# EAGLE design Instruction Register (EAGLE 9.6.1)
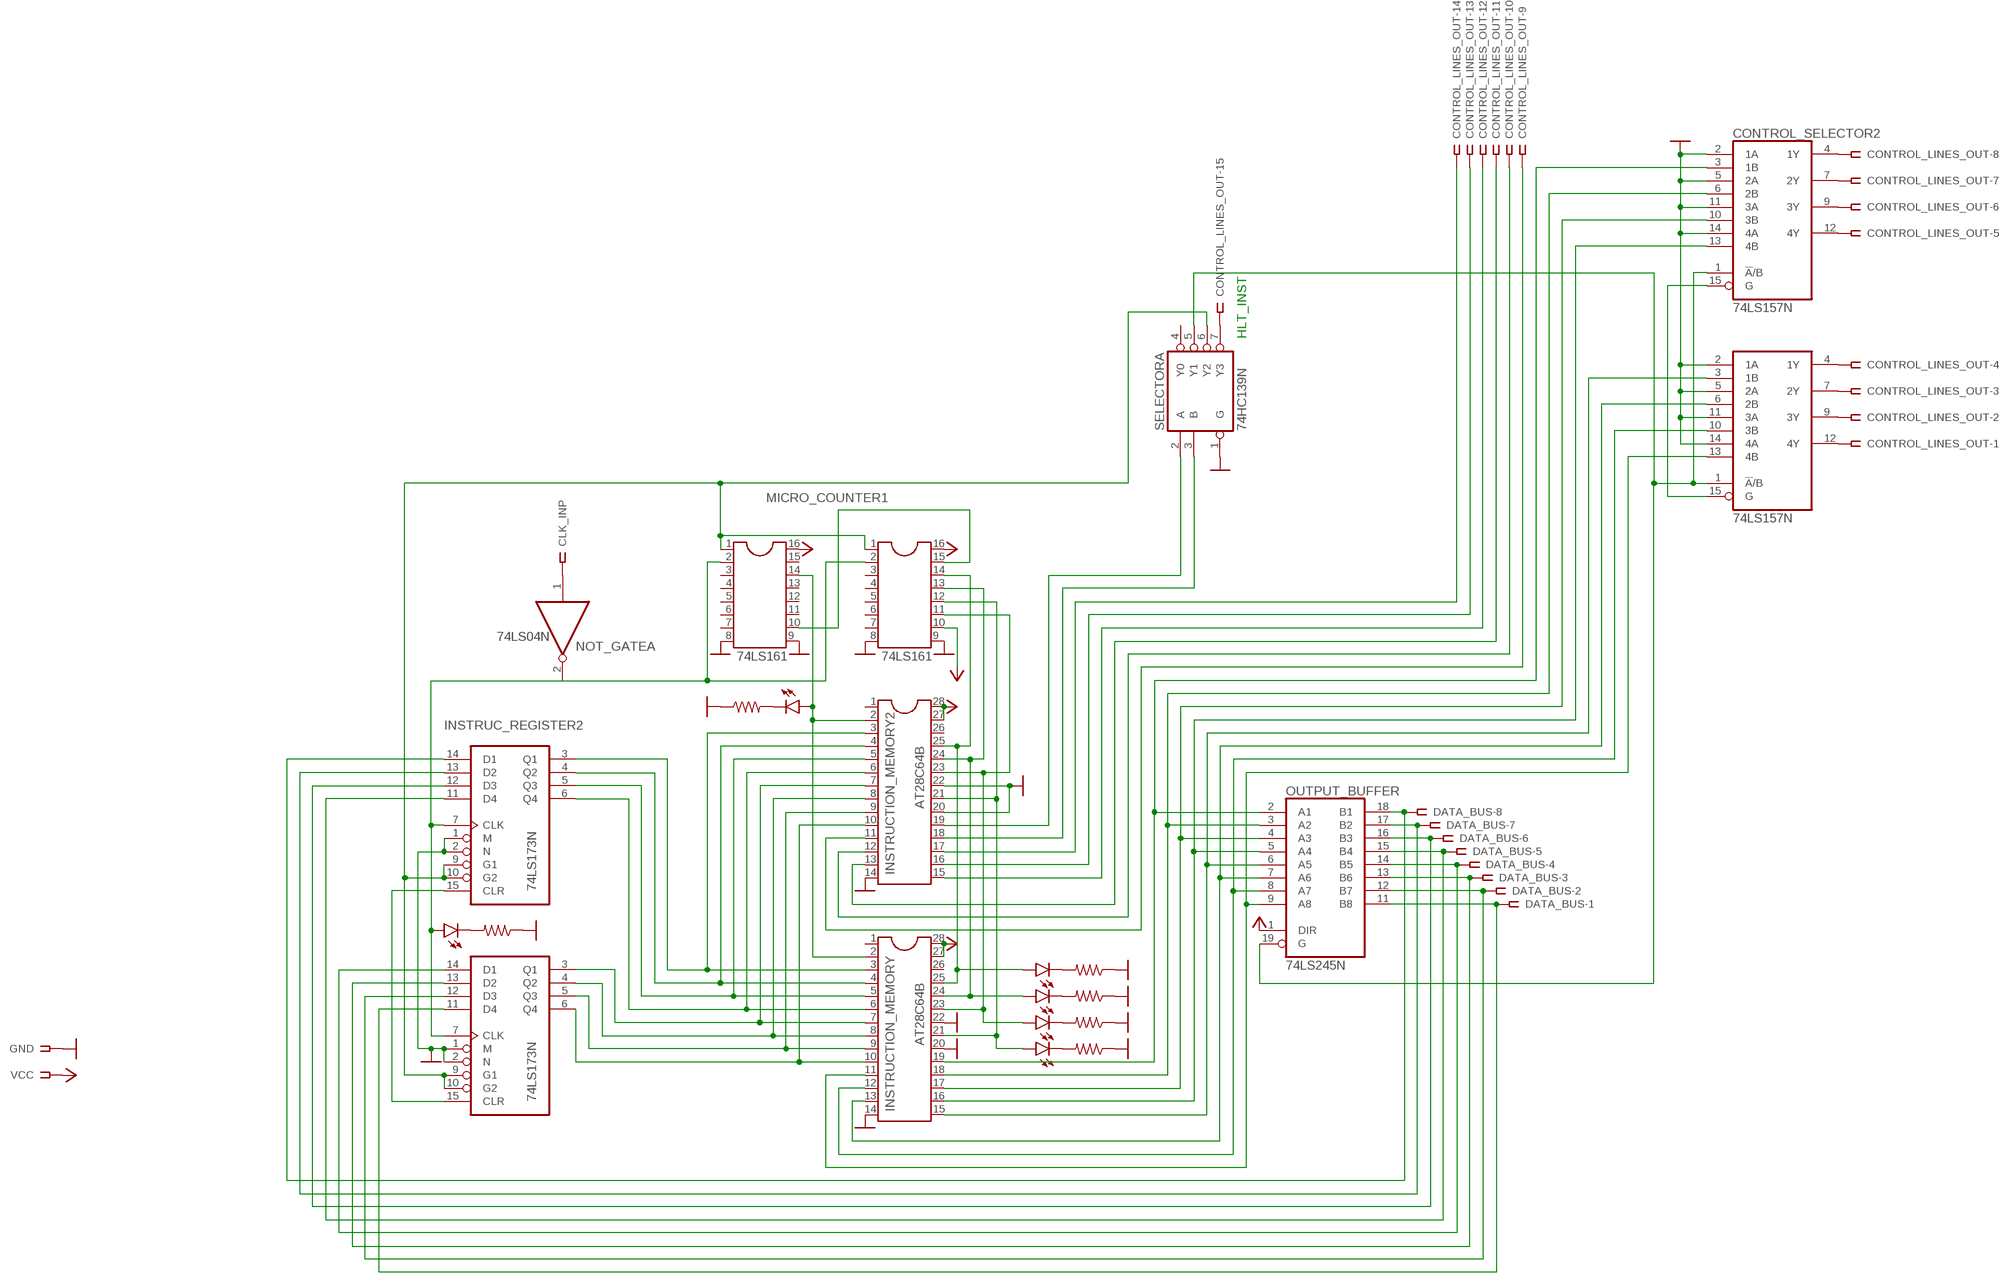
[diagram p0: schematic, sheet 1]

## Parts
CLK_INP  SSW-101-02-G-S-RA  [SSW-101-02-G-S-RA]
CONTROL_LINES_OUT  SSW-115-02-G-S  [SSW-115-02-G-S]
CONTROL_SELECTOR  74LS157N  [DIL16]
CONTROL_SELECTOR2  74LS157N  [DIL16]
DATA_BUS  SSW-108-02-G-S  [SSW-108-02-G-S]
GND  SSW-101-02-G-S-RA  [SSW-101-02-G-S-RA]
I_ADDRESS_REGISTER  74LS173N  [DIL16]
INSTRUC_REGISTER2  74LS173N  [DIL16]
INSTRUCTION_MEMORY  AT28C64B  DIL28  [DIL28-6]
INSTRUCTION_MEMORY2  AT28C64B  DIL28  [DIL28-6]
INVERTED_CLK  LED5MM  [LED5MM]
LED18  LED5MM  [LED5MM]
LED19  LED5MM  [LED5MM]
LED20  LED5MM  [LED5MM]
LED21  LED5MM  [LED5MM]
LED22  LED5MM  [LED5MM]
MICRO_COUNTER  74LS161  DIL16  [DIL16]
MICRO_COUNTER1  74LS161  DIL16  [DIL16]
NOT_GATE  74LS04N  [DIL14]
OUTPUT_BUFFER  74LS245N  [DIL20]
R1  ~220  R-US_0204/7  [0204/7]
R18  ~220  R-US_0204/7  [0204/7]
R19  ~220  R-US_0204/7  [0204/7]
R20  ~220  R-US_0204/7  [0204/7]
R21  ~220  R-US_0204/7  [0204/7]
R22  ~220  R-US_0204/7  [0204/7]
SELECTOR  74HC139N  [DIL16]
VCC  SSW-101-02-G-S-RA  [SSW-101-02-G-S-RA]

## Nets
GND: CONTROL_SELECTOR2.2(1A) CONTROL_SELECTOR2.5(2A) CONTROL_SELECTOR2.11(3A) CONTROL_SELECTOR2.14(4A) CONTROL_SELECTOR.2(1A) CONTROL_SELECTOR.5(2A) CONTROL_SELECTOR.11(3A) CONTROL_SELECTOR.14(4A) GND.1 I_ADDRESS_REGISTER.1(M) I_ADDRESS_REGISTER.2(N) INSTRUC_REGISTER2.1(M) INSTRUC_REGISTER2.2(N) INSTRUCTION_MEMORY2.14 INSTRUCTION_MEMORY2.20 INSTRUCTION_MEMORY2.22 INSTRUCTION_MEMORY.14 INSTRUCTION_MEMORY.20 INSTRUCTION_MEMORY.22 MICRO_COUNTER1.8 MICRO_COUNTER1.9 MICRO_COUNTER.8 MICRO_COUNTER.9 R1.1 R18.1 R19.1 R20.1 R21.1 R22.1 SELECTOR.1(A:G)
N$1: I_ADDRESS_REGISTER.6(Q4) INSTRUCTION_MEMORY2.10 INSTRUCTION_MEMORY.10
N$2: I_ADDRESS_REGISTER.5(Q3) INSTRUCTION_MEMORY2.9 INSTRUCTION_MEMORY.9
N$3: I_ADDRESS_REGISTER.4(Q2) INSTRUCTION_MEMORY2.8 INSTRUCTION_MEMORY.8
N$4: I_ADDRESS_REGISTER.3(Q1) INSTRUCTION_MEMORY2.7 INSTRUCTION_MEMORY.7
N$5: INSTRUC_REGISTER2.6(Q4) INSTRUCTION_MEMORY2.6 INSTRUCTION_MEMORY.6
N$6: INSTRUC_REGISTER2.5(Q3) INSTRUCTION_MEMORY2.5 INSTRUCTION_MEMORY.5
N$7: INSTRUC_REGISTER2.4(Q2) INSTRUCTION_MEMORY2.4 INSTRUCTION_MEMORY.4
N$8: INSTRUC_REGISTER2.3(Q1) INSTRUCTION_MEMORY2.3 INSTRUCTION_MEMORY.3
N$9: CONTROL_LINES_OUT.9 INSTRUCTION_MEMORY2.11
N$10: CONTROL_SELECTOR.6(2B) INSTRUCTION_MEMORY.13 OUTPUT_BUFFER.7(A6)
N$11: CONTROL_SELECTOR2.1(!A!/B) CONTROL_SELECTOR.1(!A!/B) OUTPUT_BUFFER.19(G) SELECTOR.5(A:Y1)
N$12: CONTROL_SELECTOR2.15(G) CONTROL_SELECTOR.15(G)
N$13: CONTROL_LINES_OUT.1 CONTROL_SELECTOR.12(4Y)
N$14: CONTROL_LINES_OUT.2 CONTROL_SELECTOR.9(3Y)
N$15: CONTROL_LINES_OUT.3 CONTROL_SELECTOR.7(2Y)
N$16: CONTROL_LINES_OUT.4 CONTROL_SELECTOR.4(1Y)
N$17: CONTROL_LINES_OUT.5 CONTROL_SELECTOR2.12(4Y)
N$18: CONTROL_LINES_OUT.6 CONTROL_SELECTOR2.9(3Y)
N$19: CONTROL_LINES_OUT.7 CONTROL_SELECTOR2.7(2Y)
N$20: CONTROL_LINES_OUT.8 CONTROL_SELECTOR2.4(1Y)
N$21: INSTRUCTION_MEMORY2.19 SELECTOR.2(A:A)
N$23: I_ADDRESS_REGISTER.9(G1) I_ADDRESS_REGISTER.10(G2) INSTRUC_REGISTER2.9(G1) INSTRUC_REGISTER2.10(G2) MICRO_COUNTER1.1 MICRO_COUNTER.1 SELECTOR.6(A:Y2)
N$25: CONTROL_LINES_OUT.15 SELECTOR.7(A:Y3)
N$26: CLK_INP.1 NOT_GATE.1(A:I)
N$27: INVERTED_CLK.K(C) R1.2
N$29: DATA_BUS.1 I_ADDRESS_REGISTER.11(D4) OUTPUT_BUFFER.11(B8)
N$30: DATA_BUS.2 I_ADDRESS_REGISTER.12(D3) OUTPUT_BUFFER.12(B7)
N$31: DATA_BUS.3 I_ADDRESS_REGISTER.13(D2) OUTPUT_BUFFER.13(B6)
N$32: DATA_BUS.4 I_ADDRESS_REGISTER.14(D1) OUTPUT_BUFFER.14(B5)
N$33: DATA_BUS.5 INSTRUC_REGISTER2.11(D4) OUTPUT_BUFFER.15(B4)
N$34: DATA_BUS.6 INSTRUC_REGISTER2.12(D3) OUTPUT_BUFFER.16(B3)
N$35: DATA_BUS.7 INSTRUC_REGISTER2.13(D2) OUTPUT_BUFFER.17(B2)
N$36: DATA_BUS.8 INSTRUC_REGISTER2.14(D1) OUTPUT_BUFFER.18(B1)
N$37: CONTROL_SELECTOR.10(3B) INSTRUCTION_MEMORY.12 OUTPUT_BUFFER.8(A7)
N$38: CONTROL_SELECTOR.13(4B) INSTRUCTION_MEMORY.11 OUTPUT_BUFFER.9(A8)
N$39: CONTROL_SELECTOR.3(1B) INSTRUCTION_MEMORY.15 OUTPUT_BUFFER.6(A5)
N$40: CONTROL_SELECTOR2.13(4B) INSTRUCTION_MEMORY.16 OUTPUT_BUFFER.5(A4)
N$41: CONTROL_SELECTOR2.10(3B) INSTRUCTION_MEMORY.17 OUTPUT_BUFFER.4(A3)
N$42: CONTROL_SELECTOR2.6(2B) INSTRUCTION_MEMORY.18 OUTPUT_BUFFER.3(A2)
N$43: CONTROL_SELECTOR2.3(1B) INSTRUCTION_MEMORY.19 OUTPUT_BUFFER.2(A1)
N$45: CONTROL_LINES_OUT.11 INSTRUCTION_MEMORY2.13
N$46: CONTROL_LINES_OUT.10 INSTRUCTION_MEMORY2.12
N$47: CONTROL_LINES_OUT.12 INSTRUCTION_MEMORY2.15
N$48: CONTROL_LINES_OUT.13 INSTRUCTION_MEMORY2.16
N$49: CONTROL_LINES_OUT.14 INSTRUCTION_MEMORY2.17
N$50: INSTRUCTION_MEMORY2.18 SELECTOR.3(A:B)
N$52: MICRO_COUNTER1.10 MICRO_COUNTER.15
N$53: INSTRUCTION_MEMORY2.25 INSTRUCTION_MEMORY.25 LED18.A MICRO_COUNTER.14
N$54: INSTRUCTION_MEMORY2.24 INSTRUCTION_MEMORY.24 LED19.A MICRO_COUNTER.13
N$55: INSTRUCTION_MEMORY2.21 INSTRUCTION_MEMORY.21 LED21.A MICRO_COUNTER.12
N$56: INSTRUCTION_MEMORY2.23 INSTRUCTION_MEMORY.23 LED20.A MICRO_COUNTER.11
N$57: INSTRUCTION_MEMORY2.2 INSTRUCTION_MEMORY.2 LED22.A MICRO_COUNTER1.14
N$67: I_ADDRESS_REGISTER.15(CLR) INSTRUC_REGISTER2.15(CLR)
N$70: I_ADDRESS_REGISTER.7(CLK) INSTRUC_REGISTER2.7(CLK) INVERTED_CLK.A MICRO_COUNTER1.2 MICRO_COUNTER.2 NOT_GATE.2(A:O)
N$88: LED18.K(C) R18.2
N$89: LED19.K(C) R19.2
N$90: LED20.K(C) R20.2
N$91: LED21.K(C) R21.2
N$92: LED22.K(C) R22.2
VCC: INSTRUCTION_MEMORY2.27 INSTRUCTION_MEMORY2.28 INSTRUCTION_MEMORY.27 INSTRUCTION_MEMORY.28 MICRO_COUNTER1.16 MICRO_COUNTER.10 MICRO_COUNTER.16 OUTPUT_BUFFER.1(DIR) VCC.1
Unconnected: INSTRUCTION_MEMORY2.1 INSTRUCTION_MEMORY2.26 INSTRUCTION_MEMORY.1 INSTRUCTION_MEMORY.26 MICRO_COUNTER1.3 MICRO_COUNTER1.4 MICRO_COUNTER1.5 MICRO_COUNTER1.6 MICRO_COUNTER1.7 MICRO_COUNTER1.11 MICRO_COUNTER1.12 MICRO_COUNTER1.13 MICRO_COUNTER1.15 MICRO_COUNTER.3 MICRO_COUNTER.4 MICRO_COUNTER.5 MICRO_COUNTER.6 MICRO_COUNTER.7 NOT_GATE.3(B:I) NOT_GATE.4(B:O) NOT_GATE.5(C:I) NOT_GATE.6(C:O) NOT_GATE.8(D:O) NOT_GATE.9(D:I) NOT_GATE.10(E:O) NOT_GATE.11(E:I) NOT_GATE.12(F:O) NOT_GATE.13(F:I) SELECTOR.4(A:Y0) SELECTOR.9(B:Y3) SELECTOR.10(B:Y2) SELECTOR.11(B:Y1) SELECTOR.12(B:Y0) SELECTOR.13(B:B) SELECTOR.14(B:A) SELECTOR.15(B:G)

## Notes on the sheet
- HLT_INST

## Power pins joined to a net without a drawn wire
GND: CONTROL_SELECTOR2.8(GND) CONTROL_SELECTOR.8(GND) I_ADDRESS_REGISTER.8(GND) INSTRUC_REGISTER2.8(GND) NOT_GATE.7(P:GND) OUTPUT_BUFFER.10(GND) SELECTOR.8(P:GND)
VCC: CONTROL_SELECTOR2.16(VCC) CONTROL_SELECTOR.16(VCC) I_ADDRESS_REGISTER.16(VCC) INSTRUC_REGISTER2.16(VCC) NOT_GATE.14(P:VCC) OUTPUT_BUFFER.20(VCC) SELECTOR.16(P:VCC)

## Library data of the parts
CLK_INP GND VCC = con-samtec:SSW-101-02-G-S: THROUGH-HOLE .025" SQ POST SOCKET Source: Samtec SSW.pdf; MF: Samtec Inc.; MPN: SSW-101-02-G-S-RA; OC_FARNELL: unknown; OC_NEWARK: 11P9337
CONTROL_LINES_OUT = con-samtec:SSW-115-02-G-S: THROUGH-HOLE .025" SQ POST SOCKET Source: Samtec SSW.pdf; MF: Samtec Inc.; MPN: SSW-115-02-G-S; OC_FARNELL: unknown; OC_NEWARK: 11P9564
CONTROL_SELECTOR CONTROL_SELECTOR2 = 74xx-eu:74*157: Quadruple 2-line to 1-line data SELECTOR/MULTIPLEXER
DATA_BUS = con-samtec:SSW-108-02-G-S: THROUGH-HOLE .025" SQ POST SOCKET Source: Samtec SSW.pdf; MF: Samtec Inc.; MPN: SSW-108-02-G-S; OC_FARNELL: unknown; OC_NEWARK: 11P9448
I_ADDRESS_REGISTER INSTRUC_REGISTER2 = 74xx-eu:74*173: 4-bit D type REGISTER, 3-state
INSTRUCTION_MEMORY INSTRUCTION_MEMORY2 = ic-package:DIL28: Dual In Line
INVERTED_CLK LED18-LED22 = led:LED: LED OSRAM: - CHIPLED LG R971, LG N971, LY N971, LG Q971, LY Q971, LO R971, LY R971 LH N974, LH R974 LS Q976, LO Q976, LY Q976 LO Q996 - Hyper CHIPLED LW Q18S LB Q993, LB Q99A, LB R99A - SideLED LS A670, LO A670, LY A670, LG A670, LP A670 LB A673, LV A673, LT A673, LW A673 LH A674 LY A675 LS A676, LA A676, LO A676, LY A676, LW A676 LS A679, LY A679, LG A679 - Hyper Micro SIDELED® LS Y876, LA Y876, LO Y876, LY Y876 LT Y87S - SmartLED LW L88C, LW L88S LB L89C, LB L89S, LG L890 LS L89K, LO L89K, LY L89K LS L896, LA L896, LO L896, LY L896 - TOPLED LS T670, LO T670, LY T670, LG T670, LP T670 LSG T670, LSP T670, LSY T670, LOP T670, LYG T670 LG T671, LOG T671, LSG T671 LB T673, LV T673, LT T673, LW T673 LH T674 LS T676, LA T676, LO T676, LY T676, LB T676, LH T676, LSB T676, LW T676 LB T67C, LV T67C, LT T67C, LS T67K, LO T67K, LY T67K, LW E67C LS E67B, LA E67B, LO E67B, LY E67B, LB E67C, LV E67C, LT E67C LW T67C LS T679, LY T679, LG T679 LS T770, LO T770, LY T770, LG T770, LP T770 LB T773, LV T773, LT T773, LW T773 LH T774 LS E675, LA E675, LY E675, LS T675 LS T776, LA T776, LO T776, LY T776, LB T776 LHGB T686 LT T68C, LB T68C - Hyper Mini TOPLED® LB M676 - Mini TOPLED Santana® LG M470 LS M47K, LO M47K, LY M47K Source: http://www.osram.convergy.de LUXEON: - LUMILED® LXK2-PW12-R00, LXK2-PW12-S00, LXK2-PW14-U00, LXK2-PW14-V00 LXK2-PM12-R00, LXK2-PM12-S00, LXK2-PM14-U00 LXK2-PE12-Q00, LXK2-PE12-R00, LXK2-PE12-S00, LXK2-PE14-T00, LXK2-PE14-U00 LXK2-PB12-K00, LXK2-PB12-L00, LXK2-PB12-M00, LXK2-PB14-N00, LXK2-PB14-P00, LXK2-PB14-Q00 LXK2-PR12-L00, LXK2-PR12-M00, LXK2-PR14-Q00, LXK2-PR14-R00 LXK2-PD12-Q00, LXK2-PD12-R00, LXK2-PD12-S00 LXK2-PH12-R00, LXK2-PH12-S00 LXK2-PL12-P00, LXK2-PL12-Q00, LXK2-PL12-R00 Source: www.luxeon.com KINGBRIGHT: KA-3528ASYC Source: www.kingbright.com
MICRO_COUNTER MICRO_COUNTER1 = ic-package:DIL16: Dual In Line / Socket
NOT_GATE = 74xx-eu:74*04: Hex INVERTER
OUTPUT_BUFFER = 74xx-eu:74*245: Octal BUS TRANSCEIVER, 3-state
R1 R18-R22 = rcl:R-US_: RESISTOR, American symbol; SPICEPREFIX: R
SELECTOR = 74xx-eu:74*139: Dual 2-line to 4-line DECODER/DEMULTIPLEXER

## Board
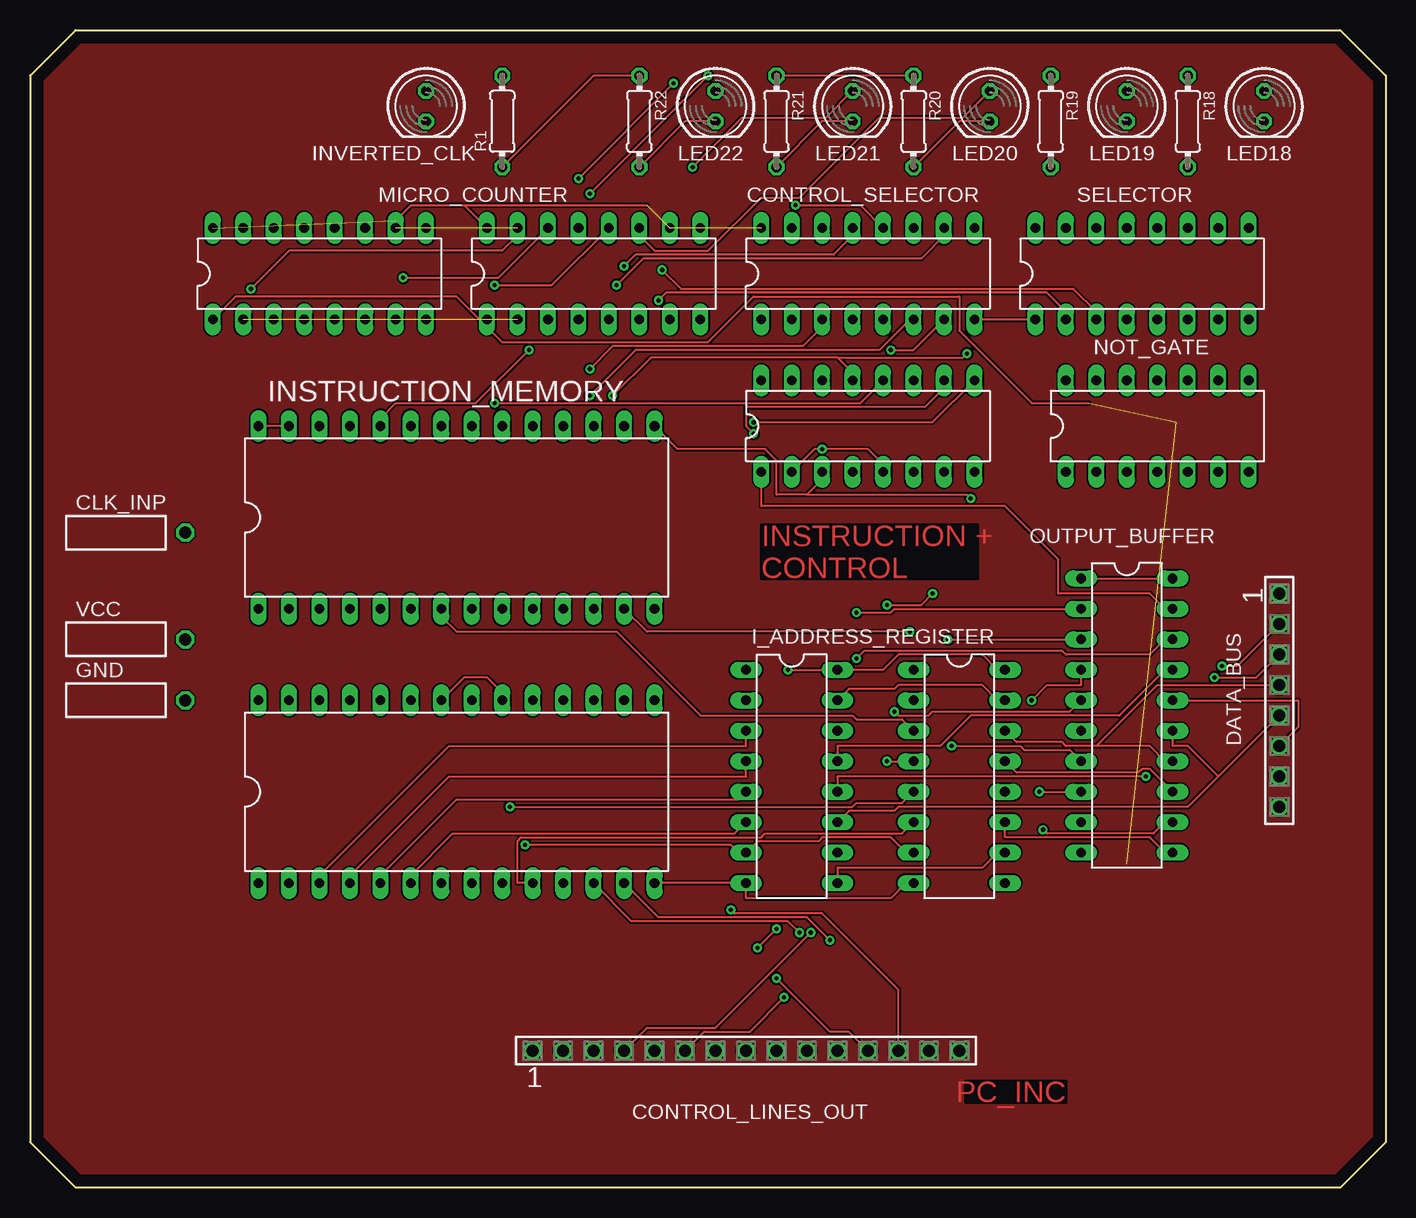
[diagram p1: board, top side]
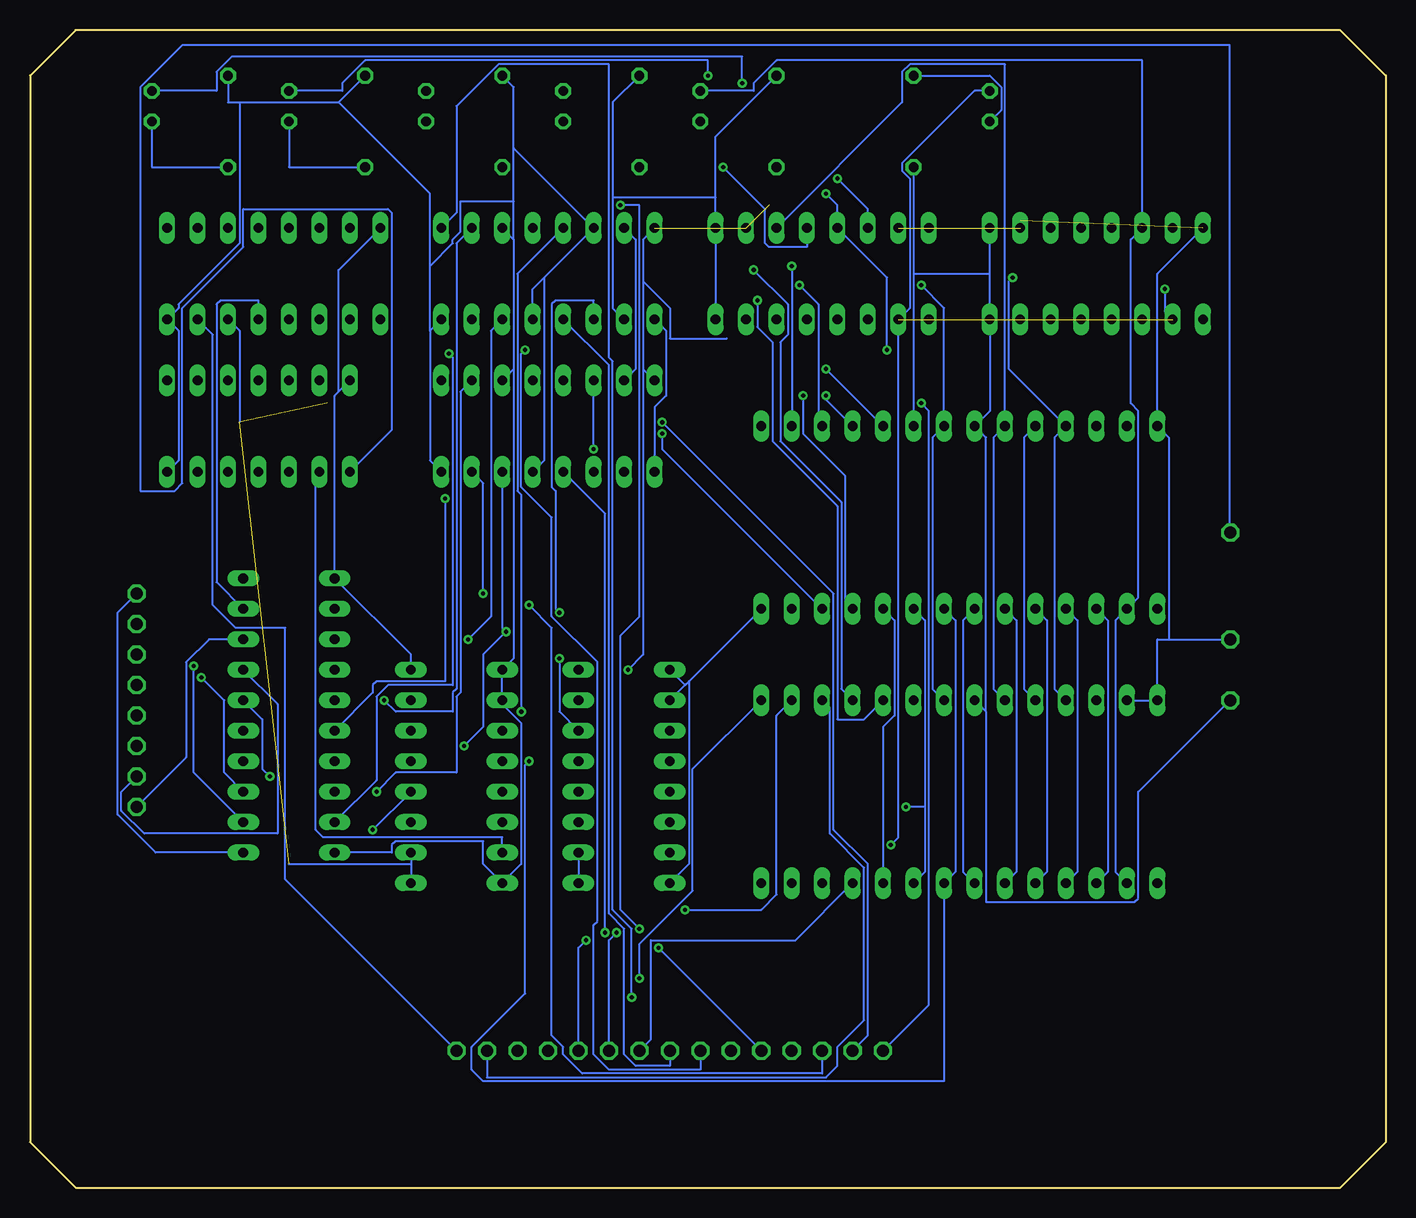
[diagram p2: board, bottom side, seen from below]

Size 113.03 x 96.52 mm. Coordinates in mm from the lower left corner, seen from the top.
Outline: 3.81,96.52 109.22,96.52 113.03,92.71 113.03,3.81 109.22,0 3.81,0 0,3.81 0,92.71 3.81,96.52
Copper layers (1*16): Top 0.035mm / dielectric 1.5mm / Bottom 0.035mm
Design rules "default": minimum track width 6mil, minimum drill 0.35mm, track to track 6mil, track to pad 6mil, pad to pad 6mil, via to via 6mil, smd to smd 6mil, copper to edge 40mil, drill to drill 6mil, minimum pad ring 10mil, minimum via ring 8mil, stop-mask expansion 4mil, vias tented up to drill 0mil, thermal gap 10mil

### Footprints (pad centres in the part's own frame; a part is rotated, then mirrored left to right if it is on the bottom)
SSW-101-02-G-S-RA = drill 1 pad 1.5 octagon: 1 0,1.524
SSW-115-02-G-S = drill 1 pad 1.5 octagon: 1 -17.78,0; 2 -15.24,0; 3 -12.7,0; 4 -10.16,0; 5 -7.62,0; 6 -5.08,0; 7 -2.54,0; 8 0,0; 9 2.54,0; 10 5.08,0; 11 7.62,0; 12 10.16,0; 13 12.7,0; 14 15.24,0; 15 17.78,0
DIL16 = drill 0.813 long: 1 -8.89,-3.81; 2 -6.35,-3.81; 3 -3.81,-3.81; 4 -1.27,-3.81; 5 1.27,-3.81; 6 3.81,-3.81; 7 6.35,-3.81; 8 8.89,-3.81; 9 8.89,3.81; 10 6.35,3.81; 11 3.81,3.81; 12 1.27,3.81; 13 -1.27,3.81; 14 -3.81,3.81; 15 -6.35,3.81; 16 -8.89,3.81
SSW-108-02-G-S = drill 1 pad 1.5 octagon: 1 -8.89,0; 2 -6.35,0; 3 -3.81,0; 4 -1.27,0; 5 1.27,0; 6 3.81,0; 7 6.35,0; 8 8.89,0
DIL28-6 = drill 0.813 long: 1 -16.51,-7.62; 2 -13.97,-7.62; 3 -11.43,-7.62; 4 -8.89,-7.62; 5 -6.35,-7.62; 6 -3.81,-7.62; 7 -1.27,-7.62; 8 1.27,-7.62; 9 3.81,-7.62; 10 6.35,-7.62; 11 8.89,-7.62; 12 11.43,-7.62; 13 13.97,-7.62; 14 16.51,-7.62; 15 16.51,7.62; 16 13.97,7.62; 17 11.43,7.62; 18 8.89,7.62; 19 6.35,7.62; 20 3.81,7.62; 21 1.27,7.62; 22 -1.27,7.62; 23 -3.81,7.62; 24 -6.35,7.62; 25 -8.89,7.62; 26 -11.43,7.62; 27 -13.97,7.62; 28 -16.51,7.62
LED5MM = drill 0.813 octagon: A -1.27,0; K 1.27,0
DIL14 = drill 0.813 long: 1 -7.62,-3.81; 2 -5.08,-3.81; 3 -2.54,-3.81; 4 0,-3.81; 5 2.54,-3.81; 6 5.08,-3.81; 7 7.62,-3.81; 8 7.62,3.81; 9 5.08,3.81; 10 2.54,3.81; 11 0,3.81; 12 -2.54,3.81; 13 -5.08,3.81; 14 -7.62,3.81
DIL20 = drill 0.813 long: 1 -11.43,-3.81; 2 -8.89,-3.81; 3 -6.35,-3.81; 4 -3.81,-3.81; 5 -1.27,-3.81; 6 1.27,-3.81; 7 3.81,-3.81; 8 6.35,-3.81; 9 8.89,-3.81; 10 11.43,-3.81; 11 11.43,3.81; 12 8.89,3.81; 13 6.35,3.81; 14 3.81,3.81; 15 1.27,3.81; 16 -1.27,3.81; 17 -3.81,3.81; 18 -6.35,3.81; 19 -8.89,3.81; 20 -11.43,3.81
0204/7 = drill 0.813 octagon: 1 -3.81,0; 2 3.81,0

### Placement (x,y rotation side)
CLK_INP  11.43,54.61 270 top
CONTROL_LINES_OUT  59.69,11.43 0 top
CONTROL_SELECTOR  69.85,63.5 0 top
CONTROL_SELECTOR2  69.85,76.2 0 top
DATA_BUS  104.14,40.64 270 top
GND  11.43,40.64 270 top
I_ADDRESS_REGISTER  77.47,34.29 270 top
INSTRUC_REGISTER2  63.5,34.29 270 top
INSTRUCTION_MEMORY  35.56,55.88 0 top
INSTRUCTION_MEMORY2  35.56,33.02 0 top
INVERTED_CLK  33.02,90.17 270 top
LED18  102.87,90.17 270 top
LED19  91.44,90.17 270 top
LED20  80.01,90.17 270 top
LED21  68.58,90.17 270 top
LED22  57.15,90.17 270 top
MICRO_COUNTER  46.99,76.2 0 top
MICRO_COUNTER1  24.13,76.2 0 top
NOT_GATE  93.98,63.5 0 top
OUTPUT_BUFFER  91.44,39.37 270 top
R1  39.37,88.9 90 top
R18  96.52,88.9 270 top
R19  85.09,88.9 270 top
R20  73.66,88.9 270 top
R21  62.23,88.9 270 top
R22  50.8,88.9 270 top
SELECTOR  92.71,76.2 0 top
VCC  11.43,45.72 270 top

### Tracks (layer width: path | path; a pad name or v marks a point on that pad's centre or on a via)
GND  (via drill 0.35)
  Top 0.152: INSTRUCTION_MEMORY2.22 36.2,42.55 38.1,42.55 39.37,41.27 INSTRUCTION_MEMORY2.20 | INSTRUCTION_MEMORY2.14 INSTRUC_REGISTER2.8 59.69,24.13 71.76,24.13 73.03,25.4 I_ADDRESS_REGISTER.8 | CONTROL_SELECTOR.2 65.41,61.59 v66.04,61.59 69.85,61.59 71.12,60.33 CONTROL_SELECTOR.5 | R20.1 R21.1 | R1.1 46.99,92.71 R22.1 | SELECTOR.1 CONTROL_SELECTOR2.8
  Bottom 0.152: 33.02,76.2 MICRO_COUNTER1.8 33.02,64.77 INSTRUCTION_MEMORY.22 33.34,62.55 33.34,39.69 | 33.02,76.2 MICRO_COUNTER1.9 | R1.1 39.37,76.2 | 39.37,76.2 INSTRUCTION_MEMORY.20 | 39.37,76.2 33.02,76.2 | 33.34,39.69 33.34,23.81 20.95,23.81 20.64,24.13 20.64,33.02 13.02,40.64 GND.1 | INSTRUCTION_MEMORY2.22 33.34,39.69 | INSTRUC_REGISTER2.2 58.42,41.91 | 58.42,41.91 58.1,42.23 | 58.1,42.23 INSTRUCTION_MEMORY.14 | 58.42,41.91 INSTRUC_REGISTER2.1 | INSTRUC_REGISTER2.8 58.1,26.99 58.1,42.23 | OUTPUT_BUFFER.10 82.87,27.94 82.87,28.58 82.55,28.89 75.25,28.89 75.25,26.99 I_ADDRESS_REGISTER.8 72.07,26.99 72.07,38.73 73.66,40.32 I_ADDRESS_REGISTER.2 I_ADDRESS_REGISTER.1 72.71,44.13 72.71,68.26 | CONTROL_SELECTOR2.2 64.45,73.34 64.45,82.55 | 64.45,82.55 64.45,90.49 R21.1 | MICRO_COUNTER.8 MICRO_COUNTER.9 55.88,82.55 | R22.1 55.88,87.63 55.88,82.55 | 55.88,82.55 64.45,82.55 | v66.04,61.59 CONTROL_SELECTOR.14 | 70.17,75.88 71.12,74.93 CONTROL_SELECTOR2.5 | 70.17,75.88 CONTROL_SELECTOR2.14 72.71,86.68 | 72.71,68.26 CONTROL_SELECTOR.11 | 72.71,79.06 72.71,68.26 | CONTROL_SELECTOR2.11 72.71,79.06 | R20.1 72.71,91.76 72.71,86.68 | 72.71,79.06 72.71,82.23 | 72.71,82.23 72.71,86.68 | CONTROL_SELECTOR.5 70.17,60.64 70.17,75.88 | NOT_GATE.7 100.65,60.64 100.65,71.44 SELECTOR.8 100.65,73.34 100.65,73.66 95.57,78.74 95.57,90.49 | 87.31,90.49 R19.1 | 95.57,90.49 96.52,90.49 R18.1 | 95.57,90.49 87.31,90.49 | CONTROL_SELECTOR.8 79.69,60.64 79.69,71.44 | CONTROL_SELECTOR2.8 79.69,71.44 | 87.31,90.49 79.69,82.87 79.69,76.83 | 79.69,71.44 79.69,76.83 | 72.71,82.23 77.15,82.23 77.15,79.69 77.79,79.06 77.79,78.74 79.69,76.83
MAIN
  pour Top: 3.81,96.52 0,92.71 0,3.81 3.81,0 109.22,0 113.03,3.81 113.03,92.71 109.22,96.52
N$1
  Top 0.152: I_ADDRESS_REGISTER.6 72.71,29.53 61.28,29.53 60.96,29.21 40.96,29.21 40.64,28.89 40.64,25.4 INSTRUCTION_MEMORY2.10
  Bottom 0.152: INSTRUCTION_MEMORY2.10 41.91,38.42 40.96,39.37 40.96,47.31 INSTRUCTION_MEMORY.10
N$2  (via drill 0.35)
  Top 0.152: I_ADDRESS_REGISTER.5 72.71,32.07 68.9,32.07 68.58,31.75 v40,31.75
  Bottom 0.152: INSTRUCTION_MEMORY2.9 38.42,26.35 38.42,31.75 | 38.42,31.75 38.42,47.31 INSTRUCTION_MEMORY.9 | 38.42,31.75 v40,31.75
N$3  (via drill 0.35)
  Top 0.152: v71.44,35.56 I_ADDRESS_REGISTER.4
  Bottom 0.152: INSTRUCTION_MEMORY.8 35.88,47.31 35.88,26.35 INSTRUCTION_MEMORY2.8 36.83,8.89 75.25,8.89 76.2,9.84 76.2,11.75 71.76,16.19 71.76,35.24 v71.44,35.56
N$4
  Top 0.152: I_ADDRESS_REGISTER.3 72.71,39.05 68.9,39.05 68.58,39.37 55.88,39.37 48.89,46.36 35.56,46.36 34.29,47.62 INSTRUCTION_MEMORY.7
  Bottom 0.152: INSTRUCTION_MEMORY2.7 35.24,26.35 35.24,47.31 INSTRUCTION_MEMORY.7
N$5
  Top 0.152: INSTRUC_REGISTER2.6 58.74,29.53 35.24,29.53 31.75,26.03 INSTRUCTION_MEMORY2.6
  Bottom 0.152: INSTRUCTION_MEMORY2.6 30.8,26.35 30.8,47.31 INSTRUCTION_MEMORY.6
N$6
  Top 0.152: INSTRUC_REGISTER2.5 59.05,32.38 35.56,32.38 29.21,26.03 INSTRUCTION_MEMORY2.5
  Bottom 0.152: INSTRUCTION_MEMORY2.5 28.26,26.35 28.26,47.31 INSTRUCTION_MEMORY.5
N$7
  Top 0.152: INSTRUC_REGISTER2.4 59.69,34.29 34.92,34.29 26.67,26.03 INSTRUCTION_MEMORY2.4
  Bottom 0.152: INSTRUCTION_MEMORY2.4 25.72,26.35 25.72,47.31 INSTRUCTION_MEMORY.4
N$8
  Top 0.152: INSTRUC_REGISTER2.3 59.69,36.83 34.92,36.83 24.13,26.03 INSTRUCTION_MEMORY2.3
  Bottom 0.152: INSTRUCTION_MEMORY2.3 23.18,26.35 23.18,47.31 INSTRUCTION_MEMORY.3
N$9
  Bottom 0.152: INSTRUCTION_MEMORY2.11 49.21,20.64 61.28,20.64 61.28,12.38 CONTROL_LINES_OUT.9
N$10  (via drill 0.35)
  Top 0.152: INSTRUCTION_MEMORY.13 51.43,46.36 v73.34,46.36 | OUTPUT_BUFFER.7 86.68,36.51 82.87,36.51 82.55,36.83 v76.84,36.83
  Bottom 0.152: CONTROL_SELECTOR.6 73.66,46.67 v73.34,46.36 75.25,44.45 75.25,38.42 v76.84,36.83
N$11
  Top 0.152: CONTROL_SELECTOR.1 60.96,56.83 81.28,56.83 85.73,52.39 85.73,49.53 93.34,49.53 94.62,48.26 OUTPUT_BUFFER.19
  Bottom 0.152: CONTROL_SELECTOR.1 60.96,65.09 60.01,66.04 60.01,71.44 CONTROL_SELECTOR2.1 | OUTPUT_BUFFER.19 97.47,50.48 97.47,73.66 97.16,73.98 93.98,73.98 SELECTOR.5
N$12
  Bottom 0.152: CONTROL_SELECTOR.15 62.55,68.26 62.55,79.06 CONTROL_SELECTOR2.15
N$13  (via drill 0.35)
  Top 0.152: CONTROL_SELECTOR.12 69.22,65.41 v38.73,65.41
  Bottom 0.152: v38.73,65.41 38.1,64.77 38.1,15.24 CONTROL_LINES_OUT.1
N$14  (via drill 0.35)
  Top 0.152: CONTROL_SELECTOR.9 75.25,63.82 v60.32,63.82
  Bottom 0.152: v60.32,63.82 46.04,49.53 46.04,29.84 43.18,26.99 43.18,12.7 CONTROL_LINES_OUT.2
N$15  (via drill 0.35)
  Top 0.152: v75.25,49.53 74.3,48.58 v71.44,48.58
  Bottom 0.152: CONTROL_SELECTOR.7 75.25,58.74 v75.25,49.53 | v71.44,48.58 69.53,46.67 69.53,12.7 68.58,11.75 68.58,11.11 66.99,9.52 46.99,9.52 CONTROL_LINES_OUT.3
N$16  (via drill 0.35)
  Top 0.152: v65.09,21.27 57.15,13.34 51.43,13.34 CONTROL_LINES_OUT.4
  Bottom 0.152: CONTROL_SELECTOR.4 65.09,56.2 v65.09,21.27
N$17  (via drill 0.35)
  Top 0.152: CONTROL_SELECTOR2.12 69.22,81.91 v63.82,81.91 | v60.64,20 v62.23,21.59
  Bottom 0.152: v63.82,81.91 62.23,81.91 62.23,47.62 63.82,46.04 63.82,23.18 v62.23,21.59 | CONTROL_LINES_OUT.5 v60.64,20
N$18  (via drill 0.35)
  Top 0.152: v62.87,15.88 60.01,13.02 56.2,13.02 CONTROL_LINES_OUT.6
  Bottom 0.152: CONTROL_SELECTOR2.9 77.47,81.28 77.47,90.17 73.98,93.66 64.77,93.66 64.77,69.22 64.45,68.9 64.45,23.18 62.87,21.59 v62.87,15.88
N$19  (via drill 0.35)
  Top 0.152: CONTROL_SELECTOR2.7 73.66,69.85 v71.76,69.85
  Bottom 0.152: v71.76,69.85 72.07,69.53 72.07,58.42 69.53,55.88 69.53,47.62 65.72,43.82 65.72,22.23 66.04,21.91 66.04,11.11 64.77,9.84 57.15,9.84 CONTROL_LINES_OUT.7
N$20
  Bottom 0.152: CONTROL_SELECTOR2.4 64.77,68.58 64.77,22.86 63.5,21.59 63.5,11.11 62.55,10.16 59.69,10.16 CONTROL_LINES_OUT.8
N$21  (via drill 0.35)
  Top 0.152: v52.39,73.98 53.02,74.61 84.77,74.61 86.36,73.02 SELECTOR.2
  Bottom 0.152: INSTRUCTION_MEMORY2.19 43.5,39.05 45.72,39.05 45.72,56.83 51.12,62.23 51.12,70.48 52.39,71.75 v52.39,73.98
N$23  (2 unrouted)
  Top 0.152: MICRO_COUNTER1.1 17.15,74.29 35.56,74.29 37.46,72.39 | 88.27,65.41 83.5,65.41 77.47,71.44 77.47,74.29 60.32,74.29 56.52,70.48 39.37,70.48 37.46,72.39 | 37.46,72.39 MICRO_COUNTER.1 | INSTRUC_REGISTER2.9 67.31,26.67 79.38,26.67 80.65,27.94 I_ADDRESS_REGISTER.10
  Bottom 0.152: INSTRUC_REGISTER2.10 INSTRUC_REGISTER2.9 | I_ADDRESS_REGISTER.10 81.28,26.99 | 81.28,26.99 I_ADDRESS_REGISTER.9 | 95.57,63.82 95.57,71.44 SELECTOR.6 | 91.44,26.99 81.28,26.99
N$25
  Bottom 0.152: SELECTOR.7 97.79,71.12 97.79,48.58 95.89,46.67 91.76,46.67 91.76,25.72 CONTROL_LINES_OUT.15
N$26
  Bottom 0.152: NOT_GATE.1 82.87,63.18 82.87,81.28 83.19,81.6 95.25,81.6 95.25,78.42 100.33,73.34 100.33,58.74 100.97,58.1 103.82,58.1 103.82,91.76 100.33,95.25 13.02,95.25 13.02,54.61 CLK_INP.1
N$27
  Bottom 0.152: INVERTED_CLK.K 32.07,89.85 32.07,91.76 33.02,92.71 R1.2
N$29
  Top 0.152: I_ADDRESS_REGISTER.11 81.28,29.21 93.34,29.21 94.62,27.94 OUTPUT_BUFFER.11
  Bottom 0.152: DATA_BUS.1 105.73,47.94 105.73,31.12 102.55,27.94 OUTPUT_BUFFER.11
N$30  (via drill 0.35)
  Top 0.152: v84.46,29.84 84.77,29.53 93.66,29.53 94.62,30.48 OUTPUT_BUFFER.12 | DATA_BUS.2 100.65,43.5 v99.38,43.5
  Bottom 0.152: v84.46,29.84 I_ADDRESS_REGISTER.12 | v99.38,43.5 99.38,34.61 OUTPUT_BUFFER.12
N$31  (via drill 0.35)
  Top 0.152: I_ADDRESS_REGISTER.13 82.23,34.61 92.39,34.61 92.71,34.92 93.34,34.92 OUTPUT_BUFFER.13 | DATA_BUS.3 102.23,42.55 v98.74,42.55
  Bottom 0.152: v98.74,42.55 96.84,40.64 96.84,34.61 OUTPUT_BUFFER.13
N$32
  Top 0.152: I_ADDRESS_REGISTER.14 82.23,37.15 86.04,37.15 86.36,36.83 88.9,36.83 | 88.9,36.83 93.34,36.83 94.62,35.56 OUTPUT_BUFFER.14 | DATA_BUS.4 93.98,41.91 88.9,36.83
N$33
  Top 0.152: INSTRUC_REGISTER2.11 68.26,31.43 72.07,31.43 72.39,31.75 96.52,31.75 99.06,34.29 | DATA_BUS.5 99.06,34.29 | OUTPUT_BUFFER.15 95.25,36.83 96.52,36.83 99.06,34.29
N$34  (via drill 0.35)
  Top 0.152: INSTRUC_REGISTER2.12 67.31,34.29 v93.03,34.29 | DATA_BUS.6 105.73,38.42 105.73,40.64 OUTPUT_BUFFER.16
  Bottom 0.152: v93.03,34.29 93.66,34.92 93.66,39.05 OUTPUT_BUFFER.16
N$35
  Top 0.152: INSTRUC_REGISTER2.13 67.31,36.83 75.88,36.83 78.42,39.37 90.81,39.37 94.62,43.18 OUTPUT_BUFFER.17
  Bottom 0.152: DATA_BUS.7 105.41,33.02 105.41,31.43 103.51,29.53 92.39,29.53 92.39,40.32 OUTPUT_BUFFER.17
N$36  (via drill 0.35)
  Top 0.152: v68.9,44.13 69.53,44.77 86.04,44.77 86.36,44.45 93.34,44.45 94.62,45.72 OUTPUT_BUFFER.18
  Bottom 0.152: INSTRUC_REGISTER2.14 68.9,39.69 v68.9,44.13 | DATA_BUS.8 100.01,35.88 100.01,43.82 98.11,45.72 OUTPUT_BUFFER.18
N$37  (via drill 0.35)
  Top 0.152: v60.32,62.87 59.69,63.5 59.69,65.09 74.61,65.09 76.2,66.67 CONTROL_SELECTOR.10 | v84.14,33.02 OUTPUT_BUFFER.8
  Bottom 0.152: INSTRUCTION_MEMORY.12 60.32,61.59 v60.32,62.87 | v84.14,33.02 82.55,34.61 77.47,34.61 77.47,40.96 77.15,41.27 77.15,66.36 CONTROL_SELECTOR.10
N$38  (via drill 0.35)
  Top 0.152: v48.58,66.04 51.75,69.22 67.31,69.22 | 67.31,69.22 68.58,67.94 CONTROL_SELECTOR.13 | v78.11,69.53 77.79,69.22 67.31,69.22
  Bottom 0.152: INSTRUCTION_MEMORY.11 45.09,48.9 45.09,59.37 48.58,62.87 v48.58,66.04 | OUTPUT_BUFFER.9 84.14,33.97 84.14,40.96 83.19,41.91 77.79,41.91 77.79,69.22 v78.11,69.53
N$39  (via drill 0.35)
  Top 0.152: INSTRUCTION_MEMORY.15 53.98,61.59 61.28,61.59 62.23,60.64 62.23,57.79 64.77,57.79 | 64.77,57.79 66.04,59.05 CONTROL_SELECTOR.3 | v78.42,57.47 78.11,57.79 64.77,57.79
  Bottom 0.152: OUTPUT_BUFFER.6 84.46,41.27 84.46,41.91 84.14,42.23 78.42,42.23 v78.42,57.47
N$40  (via drill 0.35)
  Top 0.152: v49.53,76.83 50.48,77.79 66.99,77.79 68.58,79.38 CONTROL_SELECTOR2.13 | OUTPUT_BUFFER.5 86.68,39.69 75.25,39.69 74.93,39.37 72.39,39.37 v72.07,39.69
  Bottom 0.152: v49.53,76.83 INSTRUCTION_MEMORY.16 | v72.07,39.69 72.07,57.79 72.39,58.1 72.39,76.2 CONTROL_SELECTOR2.13
N$41  (via drill 0.35)
  Top 0.152: v48.89,75.25 51.12,77.47 74.3,77.47 76.2,79.38 CONTROL_SELECTOR2.10 | OUTPUT_BUFFER.4 87.63,41.91 84.77,41.91 v83.5,40.64
  Bottom 0.152: INSTRUCTION_MEMORY.17 47.31,63.82 47.31,73.66 v48.89,75.25 | v83.5,40.64 82.55,39.69 77.79,39.69 77.79,41.27 77.47,41.59 77.47,78.74 CONTROL_SELECTOR2.10
N$42  (via drill 0.35)
  Top 0.152: v46.67,66.04 50.48,69.85 70.8,69.85 73.34,72.39 CONTROL_SELECTOR2.6 | v76.52,45.72 OUTPUT_BUFFER.3
  Bottom 0.152: INSTRUCTION_MEMORY.18 46.67,65.72 v46.67,66.04 | v76.52,45.72 74.61,47.62 74.61,71.44 CONTROL_SELECTOR2.6
N$43  (via drill 0.35)
  Top 0.152: v46.67,68.26 48.58,70.17 64.45,70.17 66.04,71.75 CONTROL_SELECTOR2.3 | OUTPUT_BUFFER.2 72.07,48.26 71.76,47.94 v68.9,47.94
  Bottom 0.152: v46.67,68.26 INSTRUCTION_MEMORY.19 | v68.9,47.94 69.22,48.26 69.22,58.1 69.53,58.42 69.53,73.66 69.22,73.98 66.04,73.98 CONTROL_SELECTOR2.3
N$45  (via drill 0.35)
  Top 0.152: INSTRUCTION_MEMORY2.13 52.39,22.54 64.77,22.54 v66.68,20.64
  Bottom 0.152: v66.68,20.64 67.31,20 CONTROL_LINES_OUT.11
N$46  (via drill 0.35)
  Top 0.152: INSTRUCTION_MEMORY2.12 50.16,22.23 63.18,22.23 v64.14,21.27
  Bottom 0.152: v64.14,21.27 64.77,20.64 CONTROL_LINES_OUT.10
N$47  (via drill 0.35)
  Top 0.152: v62.23,17.46 66.68,13.02 68.26,13.02 CONTROL_LINES_OUT.12
  Bottom 0.152: INSTRUCTION_MEMORY2.15 57.79,34.92 57.79,24.77 62.23,20.32 v62.23,17.46
N$48  (via drill 0.35)
  Top 0.152: v58.42,23.18 58.74,22.86 66.04,22.86 72.39,16.51 CONTROL_LINES_OUT.13
  Bottom 0.152: INSTRUCTION_MEMORY2.16 50.8,39.37 50.8,24.45 52.07,23.18 v58.42,23.18
N$49
  Bottom 0.152: INSTRUCTION_MEMORY2.17 46.35,40.01 46.35,29.53 43.5,26.67 43.5,13.97 45.72,11.75 45.72,10.16 46.67,9.21 74.93,9.21 CONTROL_LINES_OUT.14
N$50  (via drill 0.35)
  Top 0.152: v52.7,76.52 54.29,74.93 87,74.93 88.9,73.02 SELECTOR.3
  Bottom 0.152: INSTRUCTION_MEMORY2.18 45.4,41.59 45.4,57.15 50.48,62.23 50.48,70.48 49.85,71.12 49.85,73.66 v52.7,76.52
N$52  (via drill 0.35)  (1 unrouted)
  Top 0.152: v18.41,74.93 21.59,78.1 39.37,78.1 40.64,79.38 MICRO_COUNTER.15
  Bottom 0.152: v18.41,74.93 18.41,73.02
N$53  (via drill 0.35)
  Top 0.152: MICRO_COUNTER.14 39.05,75.88 v31.12,75.88 | v45.72,84.14 v53.66,92.07
  Bottom 0.152: INSTRUCTION_MEMORY2.25 27.62,41.59 27.62,62.55 INSTRUCTION_MEMORY.25 31.43,68.26 31.43,75.56 v31.12,75.88 | LED18.A 97.47,91.44 97.47,93.03 96.2,94.3 53.66,94.3 v53.66,92.07 | v45.72,84.14 43.18,81.6 MICRO_COUNTER.14
N$54  (via drill 0.35)
  Top 0.152: v41.59,69.85 37.15,65.41 30.48,65.41 29.21,64.13 INSTRUCTION_MEMORY.24 | v46.67,82.87 v56.52,92.71
  Bottom 0.152: INSTRUCTION_MEMORY2.24 30.16,41.59 30.16,62.55 INSTRUCTION_MEMORY.24 | v41.59,69.85 41.59,75.88 MICRO_COUNTER.13 45.72,81.91 v46.67,82.87 | LED19.A 87,91.44 87,92.07 85.09,93.98 56.52,93.98 v56.52,92.71
N$55  (via drill 0.35)
  Top 0.152: MICRO_COUNTER.12 43.5,75.25 v38.73,75.25 | LED21.A 66.36,89.22 59.37,89.22 v55.24,85.09
  Bottom 0.152: INSTRUCTION_MEMORY2.21 37.78,41.59 37.78,62.55 INSTRUCTION_MEMORY.21 36.83,73.34 v38.73,75.25 | v55.24,85.09 51.75,81.6 51.75,78.74 51.43,78.42 48.26,78.42 MICRO_COUNTER.12
N$56
  Top 0.152: LED20.A 77.79,89.22 70.8,89.22 64.14,82.55 60.96,82.55 56.52,78.1 52.07,78.1 50.8,79.38 MICRO_COUNTER.11
  Bottom 0.152: INSTRUCTION_MEMORY2.23 32.7,41.59 32.7,62.55 INSTRUCTION_MEMORY.23 31.75,93.66 39.69,93.66 40.32,93.03 40.32,90.49 MICRO_COUNTER.11
N$57
  Bottom 0.152: INSTRUCTION_MEMORY2.2 22.54,26.35 22.54,47.31 INSTRUCTION_MEMORY.2 20.64,49.21 20.64,64.77 21.27,65.41 21.27,79.06 MICRO_COUNTER1.14 20.32,93.98 50.8,93.98 52.7,92.07 52.7,91.44 LED22.A
N$67
  Top 0.152: INSTRUC_REGISTER2.15 68.26,41.59 72.07,41.59 72.39,41.91 79.38,41.91 80.65,40.64 I_ADDRESS_REGISTER.15
N$70  (via drill 0.35)  (1 unrouted)
  Top 0.152: I_ADDRESS_REGISTER.7 73.03,27.94 71.76,29.21 66.04,29.21 65.72,28.89 60.64,28.89 INSTRUC_REGISTER2.7 59.05,27.94 58.42,28.58 v41.27,28.58
  Bottom 0.152: INVERTED_CLK.A 34.29,91.44 40.32,85.41 40.32,84.77 39.69,84.14 39.69,73.34 MICRO_COUNTER.2 40.64,29.21 v41.27,28.58 | NOT_GATE.2 89.22,59.37 89.22,29.84 88.58,29.21 73.66,29.21 I_ADDRESS_REGISTER.7
N$88
  Bottom 0.152: R18.2 102.87,85.09 LED18.K
N$89
  Bottom 0.152: R19.2 91.44,85.09 LED19.K
N$90
  Top 0.152: R20.2 77.47,88.9 LED20.K
N$91
  Top 0.152: R21.2 66.04,88.9 LED21.K
N$92
  Top 0.152: R22.2 54.61,88.9 LED22.K
VCC  (via drill 0.35)  (3 unrouted)
  Top 0.152: I_ADDRESS_REGISTER.16 80.65,43.18 79.38,44.45 72.39,44.45 71.12,43.18 INSTRUC_REGISTER2.16 v63.18,43.18 | OUTPUT_BUFFER.1 OUTPUT_BUFFER.20 | 36.2,81.91 MICRO_COUNTER.16 | 36.2,81.91 31.75,81.91 30.48,80.64 | INSTRUCTION_MEMORY.27 INSTRUCTION_MEMORY.28 | 36.2,81.91 51.43,81.91
  Bottom 0.152: I_ADDRESS_REGISTER.16 81.28,44.45 OUTPUT_BUFFER.1 87.63,66.04 87.31,66.36 | 87.31,66.36 NOT_GATE.14 | SELECTOR.16 87.31,76.52 87.31,66.36 | 61.91,68.26 CONTROL_SELECTOR.16 | 61.91,75.56 61.91,79.06 CONTROL_SELECTOR2.16 | 61.91,75.56 61.91,68.26 | 54.93,70.8 59.69,70.8 59.69,73.34 61.91,75.56 | INSTRUCTION_MEMORY2.27 INSTRUCTION_MEMORY2.28 19.05,45.72 18.1,45.72 | 18.1,45.72 VCC.1 | MICRO_COUNTER1.16 19.05,76.2 INSTRUCTION_MEMORY.28 18.1,62.55 18.1,45.72 | v63.18,43.18 61.91,44.45 61.91,68.26

### Text on the board
Top: INSTRUCTION + / CONTROL | PC_INC